# EAGLE design MSD (EAGLE 6.4)
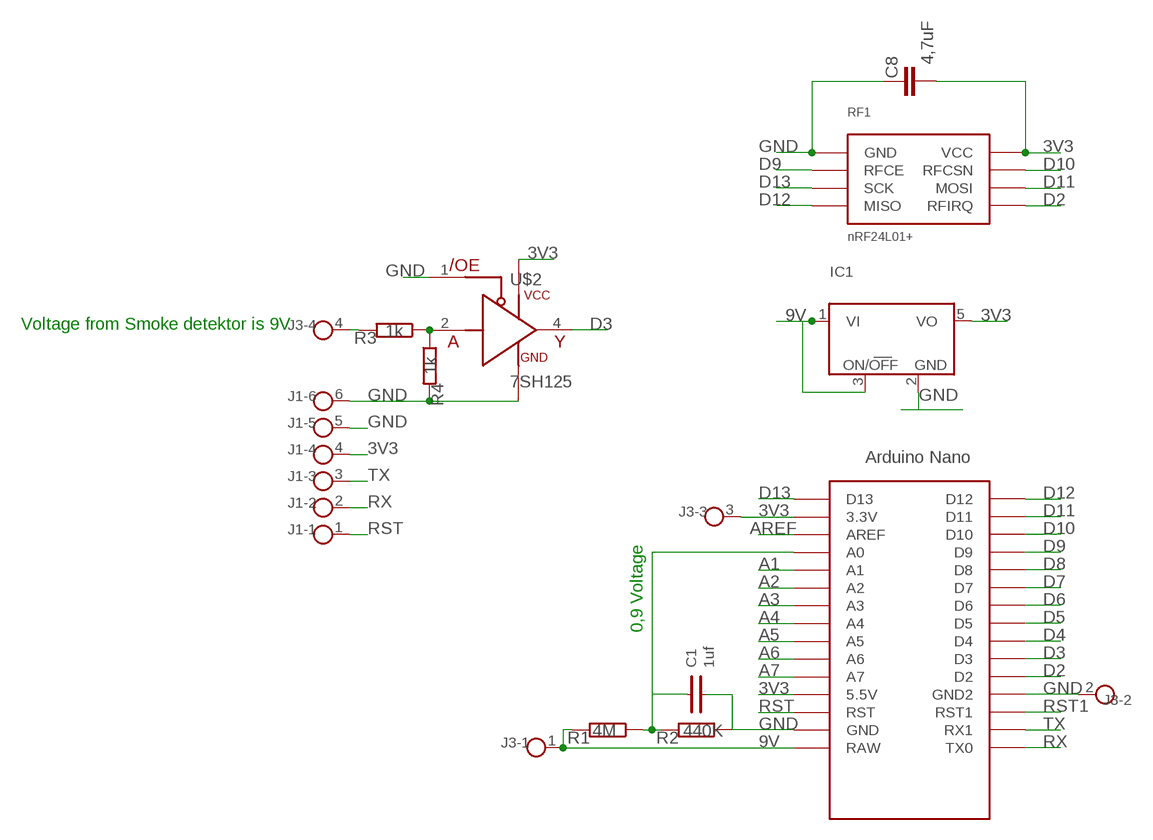
[diagram p0: schematic, sheet 1]

## Parts
C1  1uf  CC0805  [0805]
C8  4,7uF  C-EUC1206K  [C1206K]
IC1  LP2980IM5  [SOT23-5]
J1  FTDI  LIST6LIST6B  [LIST6B]
J3  LIST4  [LIST4]
R1  4M  R-EU_R0805  [R0805]
R2  440K  R-EU_R0805  [R0805]
R3  1k  R-EU_R0805  [R0805]
R4  1k  R-EU_R0805  [R0805]
RF1  nRF24L01+  NRF24L01  [2X4-2.54MM]
U$1  NANO  [NANO]
U$2  7SH125  [SOT23]

## Nets
3V3: C8.1 IC1.5(VO) J1.4 J3.3 RF1.P$2(VCC) U$1.3.3V U$1.5V(5.5V) U$2.5(VCC)
9V: IC1.1(VI) IC1.3(ON/OFF) J3.1 R1.2 U$1.RAW
A1: U$1.A1
A2: U$1.A2
A3: U$1.A3
A4: U$1.A4
A5: U$1.A5
A6: U$1.A6
A7: U$1.A7
AREF: U$1.AREF
D2: RF1.P$8(RFIRQ) U$1.D2
D3: U$1.D3 U$2.4(OUT)
D4: U$1.D4
D5: U$1.D5
D6: U$1.D6
D7: U$1.D7
D8: U$1.D8
D9: RF1.P$3(RFCE) U$1.D9
D10: RF1.P$4(RFCSN) U$1.D10
D11: RF1.P$6(MOSI) U$1.D11
D12: RF1.P$7(MISO) U$1.D12
D13: RF1.P$5(SCK) U$1.D13
GND: C1.2 C8.2 IC1.2(GND) J1.5 J1.6 J3.2 R2.1 R4.2 RF1.P$1(GND) U$1.GND U$1.GND1(GND2) U$2.1(/OE) U$2.3(GND)
N$1: J3.4 R3.2
N$2: C1.1 R1.1 R2.2 U$1.A0
N$3: R3.1 R4.1 U$2.2(A)
RST: J1.1 U$1.RST
RST1: U$1.RST1
RX: J1.2 U$1.TX0
TX: J1.3 U$1.RX1
Unconnected: U$1.ICSP1 U$1.ICSP2 U$1.ICSP3 U$1.ICSP4 U$1.ICSP5 U$1.ICSP6

## Notes on the sheet
- Voltage from Smoke detektor is 9V
- 0,9 Voltage

## Library data of the parts
C1 = rlc-smd:CC0805
C8 = rcl:C-EU: CAPACITOR, European symbol
IC1 = NATIONAL:LP2980IM5
J1 = CONNLIST:LIST6
J3 = CONNLIST:LIST4
R1-R4 = rcl:R-EU_: RESISTOR, European symbol
RF1 = matrix:NRF24L01
U$1 = AWP-Lib2:NANO: Arduino Nano
U$2 = 7sh:7SH125: Single 3.3 UHS buffer, SOT23-5 package

## Net classes
0 default: width 0.203 mm

## Board
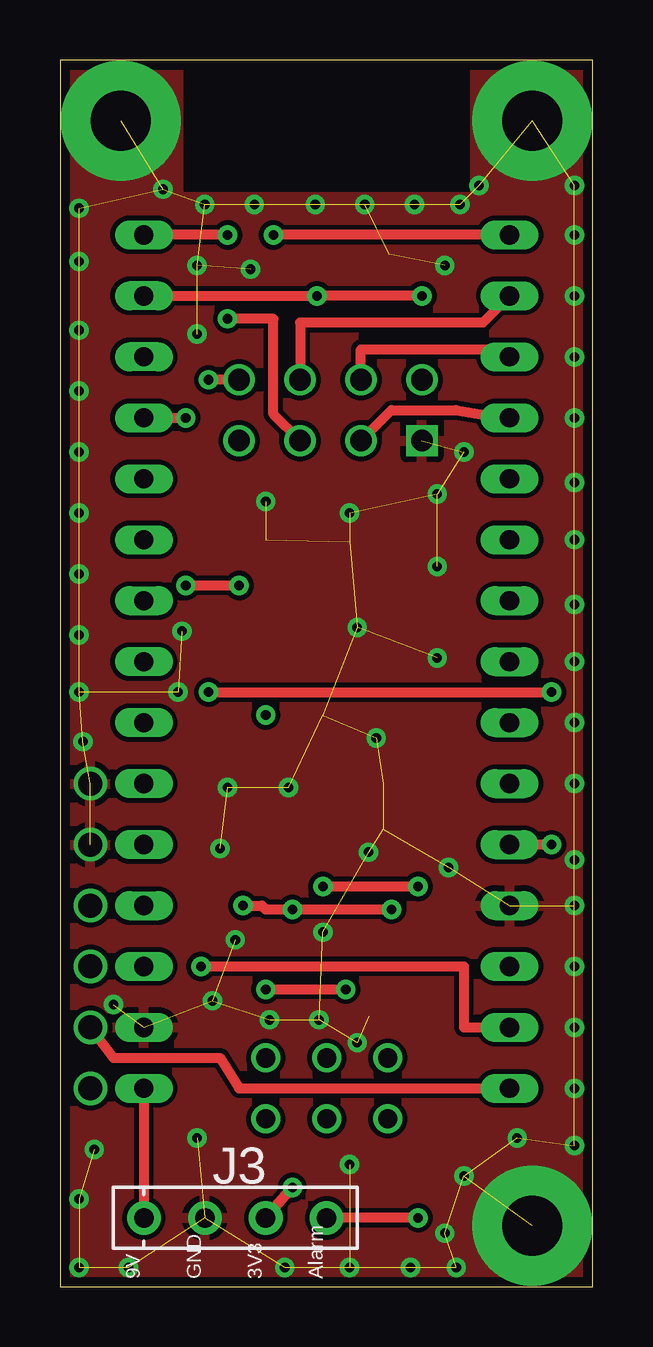
[diagram p1: board, top side]
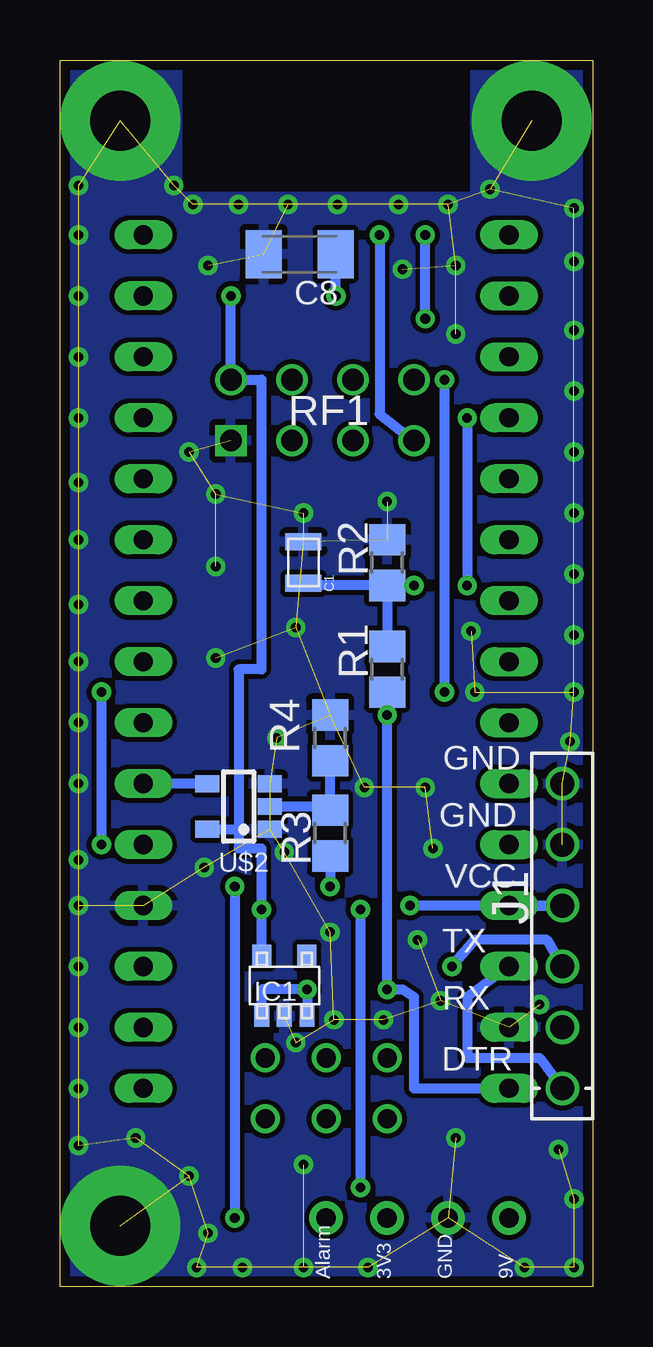
[diagram p2: board, bottom side, seen from below]

Size 22.2 x 51.1 mm. Coordinates in mm from the lower left corner, seen from the top.
Outline: 0,0 22.2,0 22.2,51.1 0,51.1 0,0
Copper layers (1*16): Top 0.035mm / dielectric 1.5mm / Bottom 0.035mm
Design rules "8mil_capinor": minimum track width 4mil, minimum drill 0.2997mm, track to track 8mil, track to pad 8mil, pad to pad 8mil, via to via 8mil, smd to smd 0mil, copper to edge 16mil, drill to drill 16mil, minimum pad ring 8mil, minimum via ring 8mil, stop-mask expansion 0mil, vias tented up to drill 16mil, thermal gap 10mil

### Footprints (pad centres in the part's own frame; a part is rotated, then mirrored left to right if it is on the bottom)
0805 = smd 0.711 x 1.499: 1 -0.864,0; 2 0.864,0
C1206K = smd 1.5 x 2: 1 -1.5,0; 2 1.5,0
SOT23-5 = smd 0.61 x 0.889: 1 -0.94,-1.27; 2 0,-1.27; 3 0.94,-1.27 | smd 0.787 x 0.889: 4 0.94,1.245; 5 -0.94,1.245
LIST6B = drill 1: 1 -6.35,0; 2 -3.81,0; 3 -1.27,0; 4 1.27,0; 5 3.81,0; 6 6.35,0
LIST4 = drill 0.813 pad 1.397: 1 -3.81,0; 2 -1.27,0; 3 1.27,0; 4 3.81,0
R0805 = smd 1.3 x 1.5: 1 -0.95,0; 2 0.95,0
2X4-2.54MM = drill 0.9 square: P$1 0,0 | drill 0.9: P$2 2.54,0; P$3 0,-2.54; P$4 2.54,-2.54; P$5 0,-5.08; P$6 2.54,-5.08; P$7 0,-7.62; P$8 2.54,-7.62
NANO = drill 0.8 long: 3.3V -10.16,24.13; 5V -10.16,-1.27; A0 -10.16,19.05; A1 -10.16,16.51; A2 -10.16,13.97; A3 -10.16,11.43; A4 -10.16,8.89; A5 -10.16,6.35; A6 -10.16,3.81; A7 -10.16,1.27; AREF -10.16,21.59; D2 5.08,1.27; D3 5.08,3.81; D4 5.08,6.35; D5 5.08,8.89; D6 5.08,11.43; D7 5.08,13.97; D8 5.08,16.51; D9 5.08,19.05; D10 5.08,21.59; D11 5.08,24.13; D12 5.08,26.67; D13 -10.16,26.67; GND -10.16,-6.35; GND1 5.08,-1.27; RAW -10.16,-8.89; RST -10.16,-3.81; RST1 5.08,-3.81; RX1 5.08,-6.35; TX0 5.08,-8.89 | drill 0.8: ICSP1 -5.08,-10.16; ICSP2 -5.08,-7.62; ICSP3 -2.54,-10.16; ICSP4 -2.54,-7.62; ICSP5 0,-10.16; ICSP6 0,-7.62
SOT23 = smd 1 x 0.7: 1 -1.3,0.95; 2 -1.293,0; 3 -1.3,-0.95; 4 1.3,-0.95; 5 1.3,0.95

### Placement (x,y rotation side)
C1  12.06,30.16 90 bottom
C8  12.22,43.02 180 bottom
IC1  12.86,12.54 0 bottom
J1  1.27,14.6 90 bottom
J3  7.3,2.86 0 top
R1  8.57,25.72 270 bottom
R2  8.57,30.16 270 bottom
R3  10.95,18.89 270 bottom
R4  10.95,22.86 90 bottom
RF1  15.08,35.24 90 bottom
U$1  13.65,17.15 0 top
U$2  14.76,20 180 bottom

### Tracks (layer width: path | path; a pad name or v marks a point on that pad's centre or on a via)
3V3  (via drill 0.4)
  Top 0.406: U$1.3.3V v10.71,41.27 v15.08,41.27 | v7.62,15.87 8.41,15.87 8.57,15.72 v9.68,15.72 v13.81,15.72 | J3.3 v9.68,4.13
  Bottom 0.406: v10.71,41.27 C8.1 | v15.08,41.27 RF1.P$2 13.81,37.78 13.81,25.72 14.76,25.72 14.76,19.05 | IC1.5 13.8,13.81 13.81,14.29 v13.81,15.72 13.81,18.26 14.76,18.26 14.76,19.05 | U$1.5V J1.4 v7.62,15.87 | v9.68,4.13 v9.68,15.72 | U$2.5 14.77,19.05 14.76,19.05
9V  (via drill 0.4)
  Top 0.406: v8.57,12.38 v11.91,12.38 | U$1.RAW J3.1
  Bottom 0.406: R1.2 v8.57,23.81 v8.57,12.38 7.94,12.38 7.46,12.06 7.46,8.25 U$1.RAW | IC1.1 13.8,12.38 v11.91,12.38 11.91,11.28 IC1.3
D2  (via drill 0.4)
  Top 0.406: RF1.P$8 v6.19,37.78 | v6.19,24.76 v20.48,24.76 | v20.48,18.41 U$1.D2
  Bottom 0.406: v6.19,37.78 v6.19,24.76 | v20.48,24.76 v20.48,18.41
D3
  Bottom 0.406: U$2.4 U$1.D3
D9
  Top 0.406: RF1.P$3 13.81,36.51 16.51,36.51 18.42,36.2 U$1.D9
D10
  Top 0.406: RF1.P$4 12.54,39.05 18.73,39.05 U$1.D10
D11
  Top 0.406: U$1.D11 17.62,40.16 10,40.16 RF1.P$6
D12  (via drill 0.4)
  Top 0.406: U$1.D12 v8.89,43.81
  Bottom 0.406: v8.89,43.81 8.89,36.35 RF1.P$7
D13  (via drill 0.4)
  Top 0.406: RF1.P$5 8.89,36.35 8.89,40.32 v6.99,40.32 | v6.99,43.81 U$1.D13
  Bottom 0.406: v6.99,40.32 v6.99,43.81
GND  (via drill 0.4, 2.5 pad 5)  (89 unrouted)
  other vias: 19.68,2.54 19.68,48.58 2.54,48.58 21.43,36.2 21.43,33.5 21.43,26.04 21.43,38.73 21.43,43.81 21.43,41.27 16.03,42.54 15.72,33.02 21.43,17.78 21.43,20.95 0.79,44.93 0.79,37.31 0.79,32.23 0.79,29.69 0.79,39.85 0.79,42.7 21.43,31.12 8.57,32.7 0.79,0.79 21.43,23.49 21.43,15.87 21.43,13.33 21.43,10.79 2.86,0.79 6.99,20.8 0.79,27.15 16.03,2.22 12.38,10.16 9.37,0.79 14.61,0.79 21.43,8.25 12.06,32.23 6.67,18.26 21.43,28.42 2.22,11.75 16.83,4.6 15.72,30 15.72,26.19 12.86,18.1 13.18,22.86 0.79,34.77 7.3,14.45 16.83,34.77 6.03,45.09 17.46,45.88 4.29,45.72 5.71,42.54 5.71,39.69 21.43,45.88 16.67,45.09 14.76,45.09 12.7,45.09 10.64,45.09 8.1,45.09 7.94,42.39 16.19,17.46 12.06,0.79 0.79,24.76 0.95,22.7 6.35,11.91 1.43,5.71 0.79,3.65 16.51,0.79 21.43,5.87 19.05,6.19 12.06,5.08 8.73,11.11 5.71,6.19 12.38,27.46 5.08,27.3 4.92,24.76 9.52,20.8 10.79,11.11 10.95,14.76
  pour Bottom: -0.32,51.28 4.92,51.43 4.92,45.4 17.3,45.4 17.3,51.28 22.38,51.28 22.54,-0.32 -0.32,-0.32
  pour Top: -0.32,51.28 4.92,51.43 4.92,45.4 17.3,45.4 17.3,51.28 22.38,51.28 22.54,-0.32 -0.32,-0.32
N$1  (via drill 0.4)
  Top 0.406: v10.95,16.67 v14.92,16.67 | v14.92,2.86 J3.4
  Bottom 0.406: R3.2 v10.95,16.67 | v14.92,16.67 v14.92,2.86
N$2  (via drill 0.4)
  Top 0.406: U$1.A0 v5.24,36.2 | v5.24,29.21 v7.46,29.21
  Bottom 0.406: R2.2 R1.1 | R2.2 12.06,29.21 C1.1 | v5.24,36.2 v5.24,29.21 | v7.46,29.21 R2.2
N$3
  Bottom 0.406: U$2.2 10.96,20 R3.1 R4.1
RST
  Bottom 0.406: U$1.RST 5.24,12.06 5.24,9.52 2.22,9.52 J1.1
RX
  Top 0.406: J1.2 2.22,9.52 6.67,9.52 7.46,8.25 U$1.TX0
TX  (via drill 0.4)
  Top 0.406: U$1.RX1 16.83,10.79 16.83,13.33 v5.87,13.33
  Bottom 0.406: J1.3 1.9,14.45 4.92,14.45 v5.87,13.33

### Text on the board
tNames: 9V | GND | 3V3 | Alarm
bNames: GND | GND | VCC | TX | RX | DTR | 9V | GND | 3V3 | Alarm